# EAGLE design prototype2-only-bot-ground-plane (EAGLE 9.3.1)

## Sheet 1 of 5
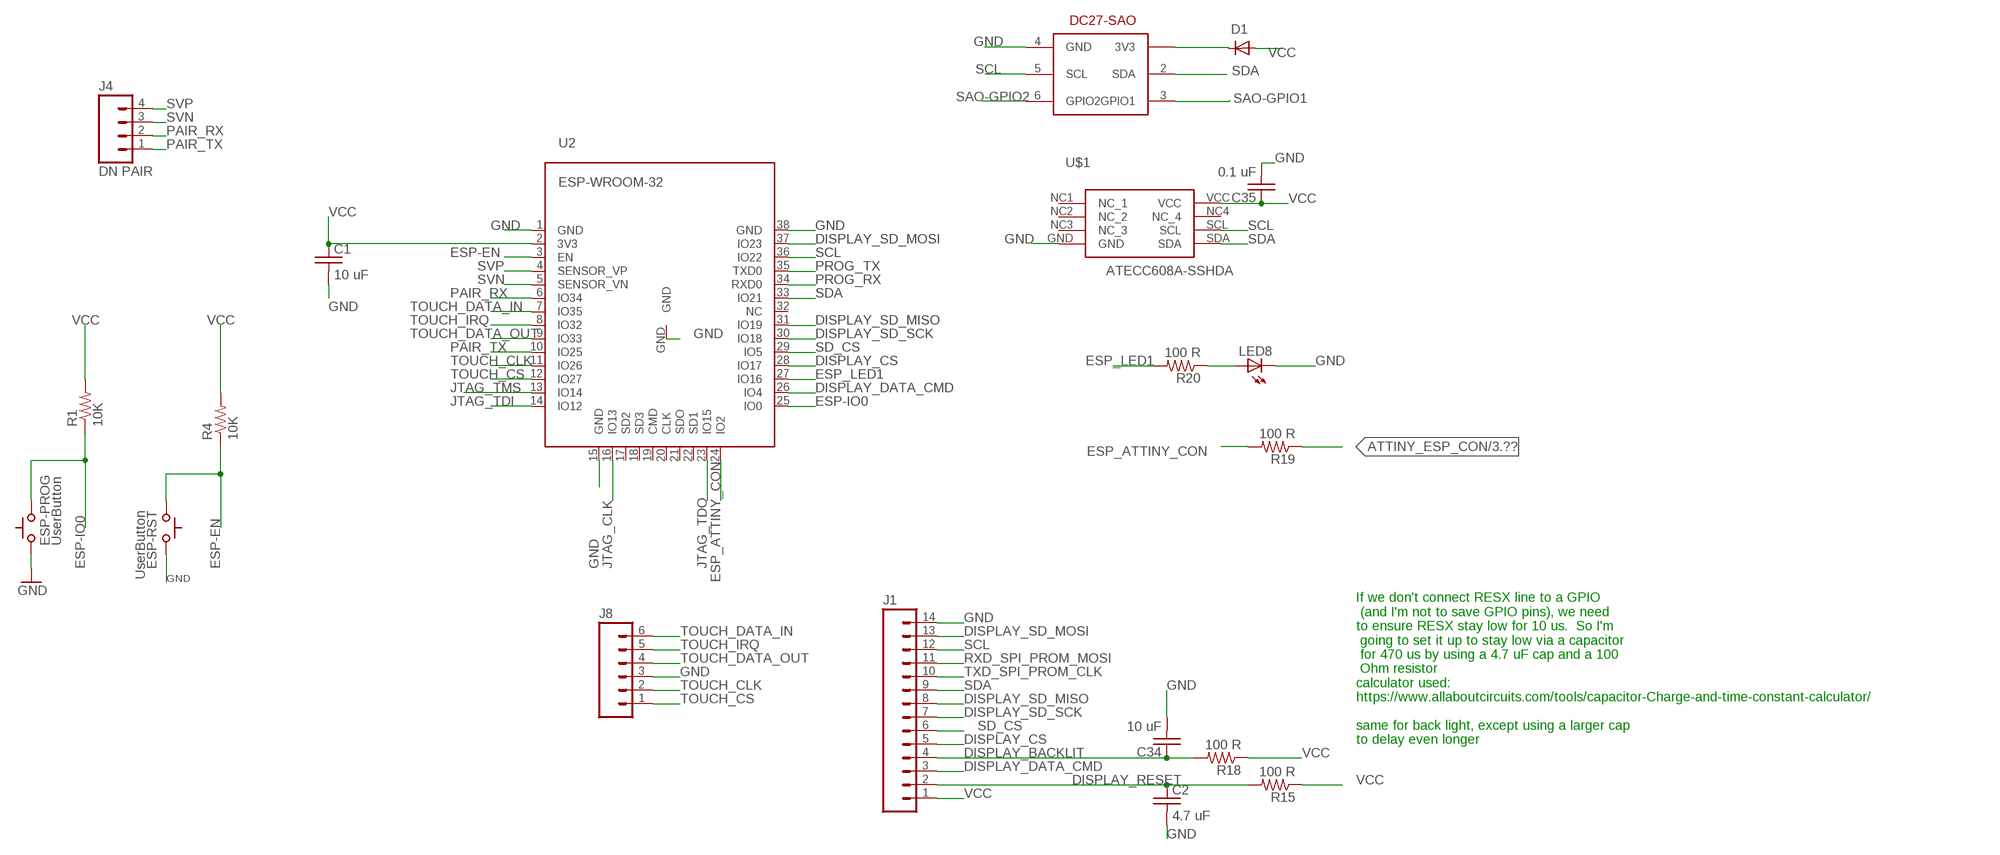
[diagram p0: schematic, sheet 1]

### Parts
C1  10 uF  C-USC0805  [C0805]
C2  4.7 uF  C-USC0805  [C0805]
C34  10 uF  C-USC0805  [C0805]
C35  0.1 uF  C-USC0805  [C0805]
D1  DIODESMA  [SMA-DIODE]
ESP-PROG  UserButton  SWITCH_TACTILETACTILE-2PIN-NARROW  [TACTILE-2PIN-NARROW]
ESP-RST  UserButton  SWITCH_TACTILETACTILE-2PIN-NARROW  [TACTILE-2PIN-NARROW]
J1  M14  [1X14]
J4  DN PAIR  M04PTH  [1X04]
J8  M06NO_SILK_YES_STOP  [1X06_NO_SILK_YES_STOP]
LED8  LED3MM  [LED3MM]
R1  10K  RESISTOR0805-RES  [0805]
R4  10K  RESISTOR0805-RES  [0805]
R15  100 R  RESISTOR0805-RES  [0805]
R18  100 R  RESISTOR0805-RES  [0805]
R19  100 R  RESISTOR0805-RES  [0805]
R20  100 R  RESISTOR0805-RES  [0805]
U2  ESP-WROOM-32  [ESP-WROOM-32]
U$1  ATECC608A-SSHDA  [8-SOIC]
U$4  DC-27-SAO  [3X2]

### Nets
ATTINY_ESP_CON: R19.1 ; also sheet 3
DISPLAY_BACKLIT: C34.1 J1.4 R18.2
DISPLAY_CS: J1.5 U2.28(IO17)
DISPLAY_DATA_CMD: J1.3 U2.26(IO4)
DISPLAY_RESET: C2.1 J1.2 R15.2
DISPLAY_SD_MISO: J1.8 U2.31(IO19)
DISPLAY_SD_MOSI: J1.13 U2.37(IO23)
DISPLAY_SD_SCK: J1.7 U2.30(IO18)
ESP-EN: ESP-RST.P$2(C) R4.1 U2.3(EN)
ESP-IO0: ESP-PROG.P$1(A) R1.1 U2.25(IO0)
ESP_ATTINY_CON: R19.2 U2.24(IO2)
ESP_LED1: R20.2 U2.27(IO16)
GND: C1.2 C2.2 C34.2 C35.2 ESP-PROG.P$2(C) ESP-RST.P$1(A) J1.14 J8.3 LED8.K(C) U2.1(GND) U2.15(GND) U2.38(GND) U2.GND U$1.GND U$4.4(GND) ; also sheet 2,3,4
JTAG_CLK: U2.16(IO13) ; also sheet 2
JTAG_TDI: U2.14(IO12) ; also sheet 2
JTAG_TDO: U2.23(IO15) ; also sheet 2
JTAG_TMS: U2.13(IO14) ; also sheet 2
N$1: D1.C U$4.1(3V3)
N$9: LED8.A R20.1
PAIR_RX: J4.2 U2.6(IO34)
PAIR_TX: J4.1 U2.10(IO25)
PROG_RX: U2.34(RXD0) ; also sheet 2
PROG_TX: U2.35(TXD0) ; also sheet 2
RXD_SPI_PROM_MOSI: J1.11 ; also sheet 2
SAO-GPIO1: U$4.3(GPIO1)
SAO-GPIO2: U$4.6(GPIO2)
SCL: J1.12 U2.36(IO22) U$1.SCL U$4.5(SCL)
SD_CS: J1.6 U2.29(IO5)
SDA: J1.9 U2.33(IO21) U$1.SDA U$4.2(SDA)
SVN: J4.3 U2.5(SENSOR_VN)
SVP: J4.4 U2.4(SENSOR_VP)
TOUCH_CLK: J8.2 U2.11(IO26)
TOUCH_CS: J8.1 U2.12(IO27)
TOUCH_DATA_IN: J8.6 U2.7(IO35)
TOUCH_DATA_OUT: J8.4 U2.9(IO33)
TOUCH_IRQ: J8.5 U2.8(IO32)
TXD_SPI_PROM_CLK: J1.10 ; also sheet 2
VCC: C1.1 C35.1 D1.A J1.1 R1.2 R4.2 R15.1 R18.1 U2.2(3V3) U$1.VCC ; also sheet 2,4
Unconnected: U2.17(SD2) U2.18(SD3) U2.19(CMD) U2.20(CLK) U2.21(SDO) U2.22(SD1) U2.32(NC) U$1.NC1(NC_1) U$1.NC2(NC_2) U$1.NC3(NC_3) U$1.NC4(NC_4)

### Notes on the sheet
- If we don't connect RESX line to a GPIO
   (and I'm not to save GPIO pins), we need 
  to ensure RESX stay low for 10 us.  So I'm
   going to set it up to stay low via a capacitor
   for 470 us by using a 4.7 uF cap and a 100
   Ohm resistor
  calculator used:
  https://www.allaboutcircuits.com/tools/capacitor-Charge-and-time-constant-calculator/
  
  same for back light, except using a larger cap 
  to delay even longer

## Sheet 2 of 5
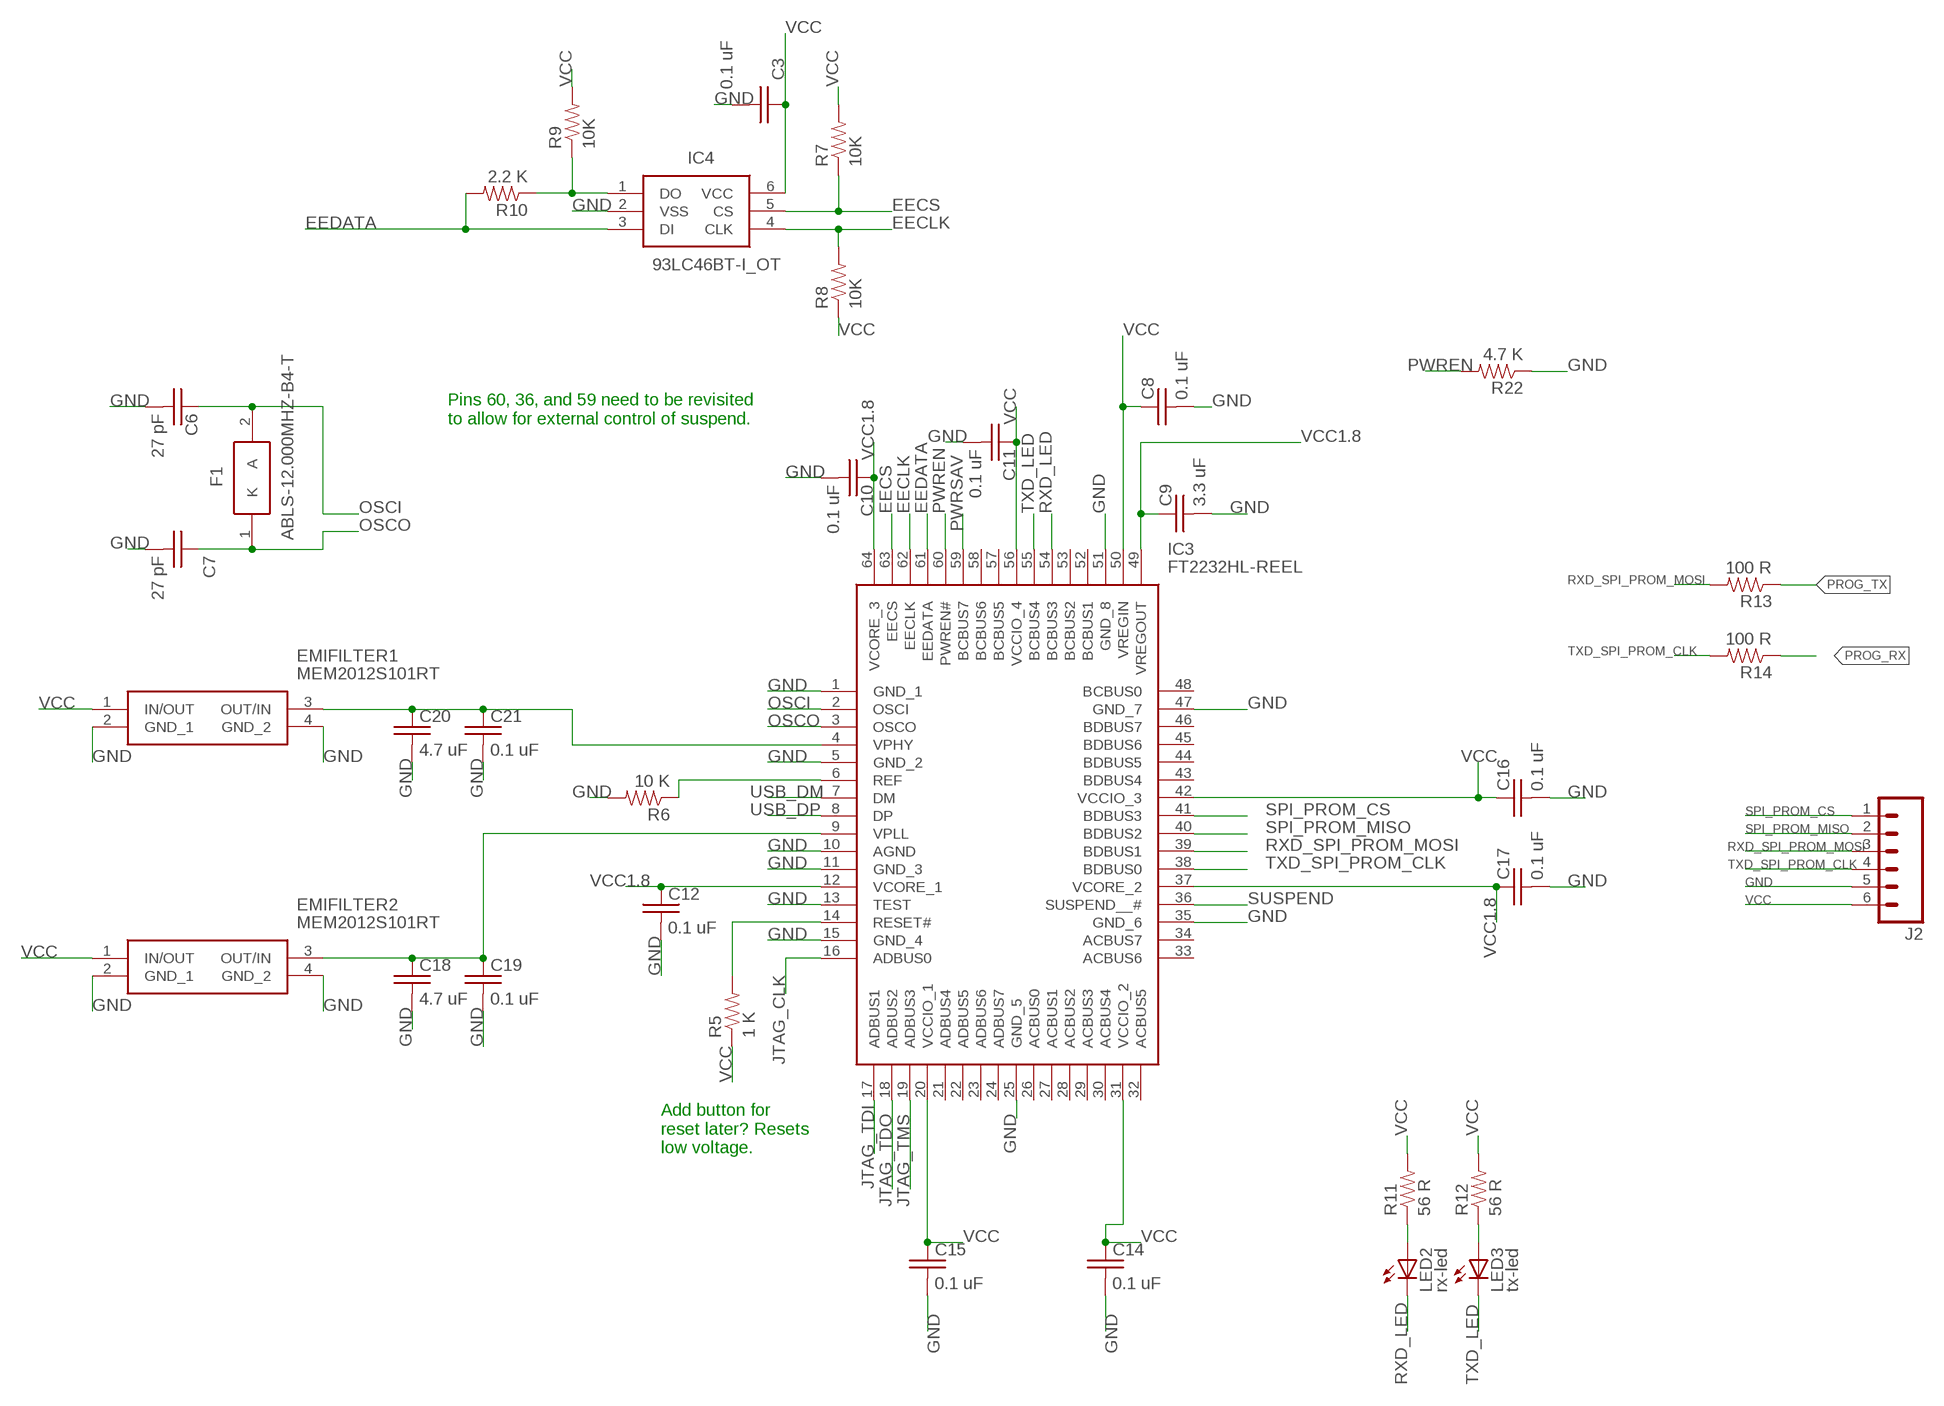
[diagram p1: schematic, sheet 2]

### Parts
C3  0.1 uF  C-USC0805  [C0805]
C6  27 pF  C-USC0805  [C0805]
C7  27 pF  C-USC0805  [C0805]
C8  0.1 uF  C-USC0805  [C0805]
C9  3.3 uF  C-USC0805  [C0805]
C10  0.1 uF  C-USC0805  [C0805]
C11  0.1 uF  C-USC0805  [C0805]
C12  0.1 uF  C-USC0805  [C0805]
C14  0.1 uF  C-USC0805  [C0805]
C15  0.1 uF  C-USC0805  [C0805]
C16  0.1 uF  C-USC0805  [C0805]
C17  0.1 uF  C-USC0805  [C0805]
C18  4.7 uF  C-USC0805  [C0805]
C19  0.1 uF  C-USC0805  [C0805]
C20  4.7 uF  C-USC0805  [C0805]
C21  0.1 uF  C-USC0805  [C0805]
EMIFILTER1  MEM2012S101RT  [MEM2012S101RT]
EMIFILTER2  MEM2012S101RT  [MEM2012S101RT]
F1  ABLS-12.000MHZ-B4-T  [HC/49US-(AT49)_1]
IC3  FT2232HL-REEL  [QFP50P1200X1200X160-64N]
IC4  93LC46BT-I_OT  [SOT95P270X145-6N]
J2  M06SILK_FEMALE_PTH  [1X06]
LED2  rx-led  LED3MM  [LED3MM]
LED3  tx-led  LED3MM  [LED3MM]
R5  1 K  RESISTOR0805-RES  [0805]
R6  10 K  RESISTOR0805-RES  [0805]
R7  10K  RESISTOR0805-RES  [0805]
R8  10K  RESISTOR0805-RES  [0805]
R9  10K  RESISTOR0805-RES  [0805]
R10  2.2 K  RESISTOR0805-RES  [0805]
R11  56 R  RESISTOR0805-RES  [0805]
R12  56 R  RESISTOR0805-RES  [0805]
R13  100 R  RESISTOR0805-RES  [0805]
R14  100 R  RESISTOR0805-RES  [0805]
R22  4.7 K  RESISTOR0805-RES  [0805]

### Nets
EECLK: IC3.62(EECLK) IC4.4(CLK) R8.2
EECS: IC3.63(EECS) IC4.5(CS) R7.1
EEDATA: IC3.61(EEDATA) IC4.3(DI) R10.2
GND: C3.2 C6.2 C7.2 C8.2 C9.2 C10.2 C11.2 C12.2 C14.2 C15.2 C16.2 C17.2 C18.2 C19.2 C20.2 C21.2 EMIFILTER1.2(GND_1) EMIFILTER1.4(GND_2) EMIFILTER2.2(GND_1) EMIFILTER2.4(GND_2) IC3.1(GND_1) IC3.5(GND_2) IC3.10(AGND) IC3.11(GND_3) IC3.13(TEST) IC3.15(GND_4) IC3.25(GND_5) IC3.35(GND_6) IC3.47(GND_7) IC3.51(GND_8) IC4.2(VSS) J2.5 R6.2 R22.1 ; also sheet 1,3,4
JTAG_CLK: IC3.16(ADBUS0) ; also sheet 1
JTAG_TDI: IC3.17(ADBUS1) ; also sheet 1
JTAG_TDO: IC3.18(ADBUS2) ; also sheet 1
JTAG_TMS: IC3.19(ADBUS3) ; also sheet 1
N$6: IC3.14(RESET#) R5.2
N$7: IC3.6(REF) R6.1
N$8: IC4.1(DO) R9.1 R10.1
N$11: LED2.A R11.1
N$13: LED3.A R12.1
N$18: C18.1 C19.1 EMIFILTER2.3(OUT/IN) IC3.9(VPLL)
N$19: C20.1 C21.1 EMIFILTER1.3(OUT/IN) IC3.4(VPHY)
OSCI: C6.1 F1.2(A) IC3.2(OSCI)
OSCO: C7.1 F1.1(K) IC3.3(OSCO)
PROG_RX: R14.1 ; also sheet 1
PROG_TX: R13.1 ; also sheet 1
PWREN: IC3.60(PWREN#) R22.2
PWRSAV: IC3.59(BCBUS7)
RXD_LED: IC3.54(BCBUS3) LED2.K(C)
RXD_SPI_PROM_MOSI: IC3.39(BDBUS1) J2.3 R13.2 ; also sheet 1
SPI_PROM_CS: IC3.41(BDBUS3) J2.1
SPI_PROM_MISO: IC3.40(BDBUS2) J2.2
SUSPEND: IC3.36(SUSPEND__#)
TXD_LED: IC3.55(BCBUS4) LED3.K(C)
TXD_SPI_PROM_CLK: IC3.38(BDBUS0) J2.4 R14.2 ; also sheet 1
USB_DM: IC3.7(DM) ; also sheet 4
USB_DP: IC3.8(DP) ; also sheet 4
VCC: C3.1 C8.1 C11.1 C14.1 C15.1 C16.1 EMIFILTER1.1(IN/OUT) EMIFILTER2.1(IN/OUT) IC3.20(VCCIO_1) IC3.31(VCCIO_2) IC3.42(VCCIO_3) IC3.50(VREGIN) IC3.56(VCCIO_4) IC4.6(VCC) J2.6 R5.1 R7.2 R8.1 R9.2 R11.2 R12.2 ; also sheet 1,4
VCC1.8: C9.1 C10.1 C12.1 C17.1 IC3.12(VCORE_1) IC3.37(VCORE_2) IC3.49(VREGOUT) IC3.64(VCORE_3)
Unconnected: IC3.21(ADBUS4) IC3.22(ADBUS5) IC3.23(ADBUS6) IC3.24(ADBUS7) IC3.26(ACBUS0) IC3.27(ACBUS1) IC3.28(ACBUS2) IC3.29(ACBUS3) IC3.30(ACBUS4) IC3.32(ACBUS5) IC3.33(ACBUS6) IC3.34(ACBUS7) IC3.43(BDBUS4) IC3.44(BDBUS5) IC3.45(BDBUS6) IC3.46(BDBUS7) IC3.48(BCBUS0) IC3.52(BCBUS1) IC3.53(BCBUS2) IC3.57(BCBUS5) IC3.58(BCBUS6)

### Notes on the sheet
- Pins 60, 36, and 59 need to be revisited 
  to allow for external control of suspend.
- Add button for 
  reset later? Resets
  low voltage.

## Sheet 3 of 5
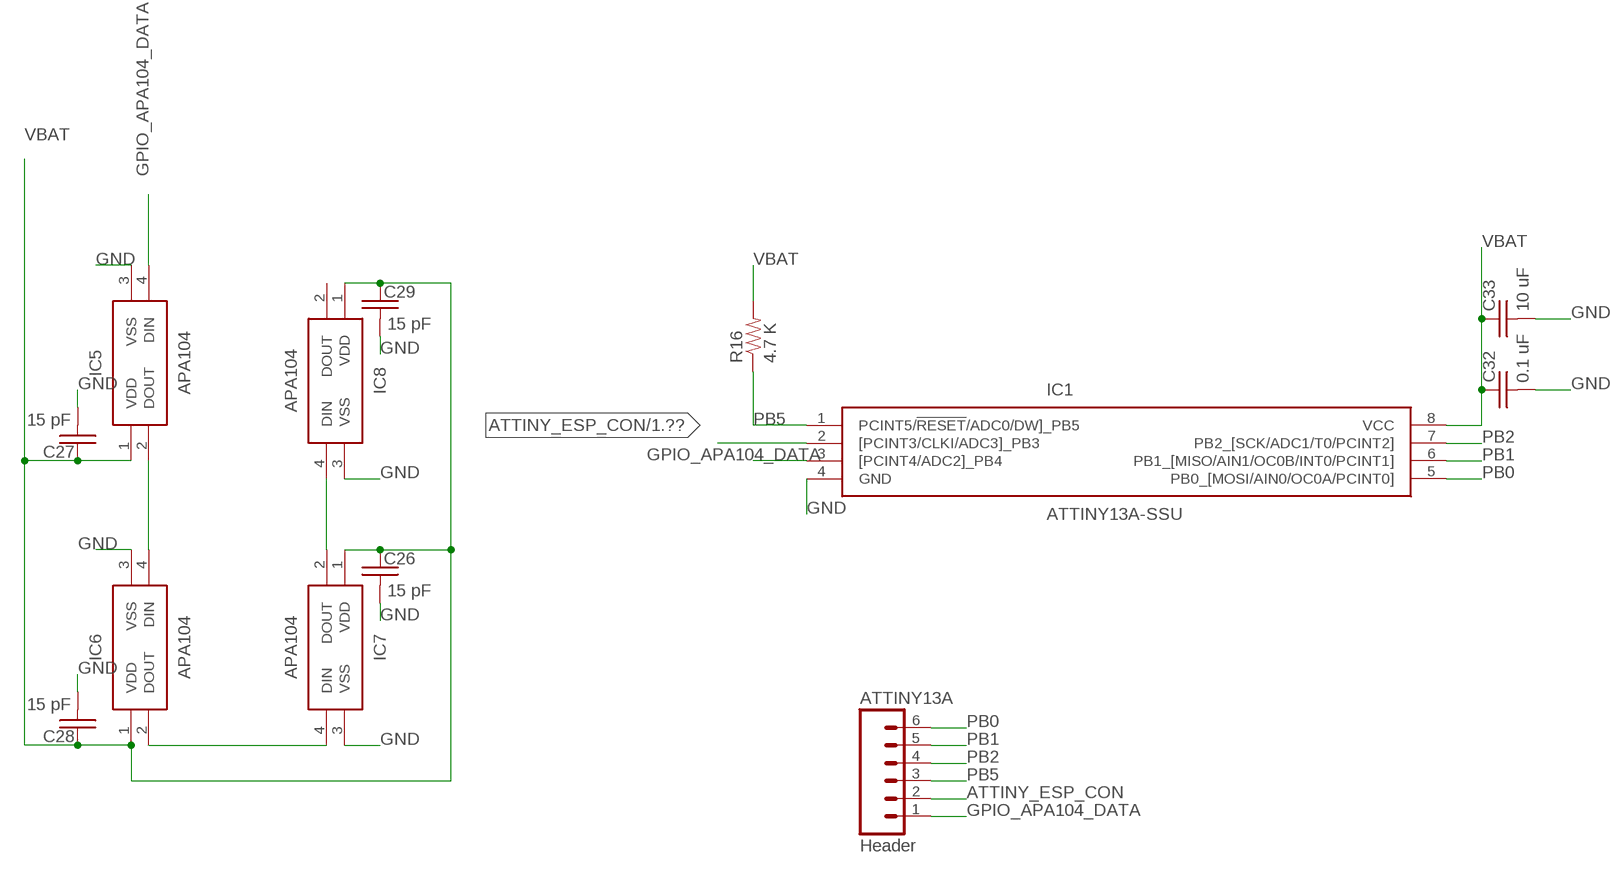
[diagram p2: schematic, sheet 3]

### Parts
ATTINY13A  Header  M06SILK_FEMALE_PTH  [1X06]
C26  15 pF  C-USC0805  [C0805]
C27  15 pF  C-USC0805  [C0805]
C28  15 pF  C-USC0805  [C0805]
C29  15 pF  C-USC0805  [C0805]
C32  0.1 uF  C-USC0805  [C0805]
C33  10 uF  C-USC0805  [C0805]
IC1  ATTINY13A-SSU  [SOIC127P600X175-8N]
IC5  APA104  [APA104]
IC6  APA104  [APA104]
IC7  APA104  [APA104]
IC8  APA104  [APA104]
R16  4.7 K  RESISTOR0805-RES  [0805]

### Nets
ATTINY_ESP_CON: ATTINY13A.2 IC1.2([PCINT3/CLKI/ADC3]_PB3) ; also sheet 1
GND: C26.2 C27.2 C28.2 C29.2 C32.2 C33.2 IC1.4(GND) IC5.3(VSS) IC6.3(VSS) IC7.3(VSS) IC8.3(VSS) ; also sheet 1,2,4
GPIO_APA104_DATA: ATTINY13A.1 IC1.3([PCINT4/ADC2]_PB4) IC5.4(DIN)
N$4: IC5.2(DOUT) IC6.4(DIN)
N$12: IC6.2(DOUT) IC7.4(DIN)
N$22: IC7.2(DOUT) IC8.4(DIN)
PB0: ATTINY13A.6 IC1.5(PB0_[MOSI/AIN0/OC0A/PCINT0])
PB1: ATTINY13A.5 IC1.6(PB1_[MISO/AIN1/OC0B/INT0/PCINT1])
PB2: ATTINY13A.4 IC1.7(PB2_[SCK/ADC1/T0/PCINT2])
PB5: ATTINY13A.3 IC1.1(PCINT5/!RESET!/ADC0/DW]_PB5) R16.1
VBAT [5v]: C26.1 C27.1 C28.1 C29.1 C32.1 C33.1 IC1.8(VCC) IC5.1(VDD) IC6.1(VDD) IC7.1(VDD) IC8.1(VDD) R16.2 ; also sheet 4
Unconnected: IC8.2(DOUT)

## Sheet 4 of 5
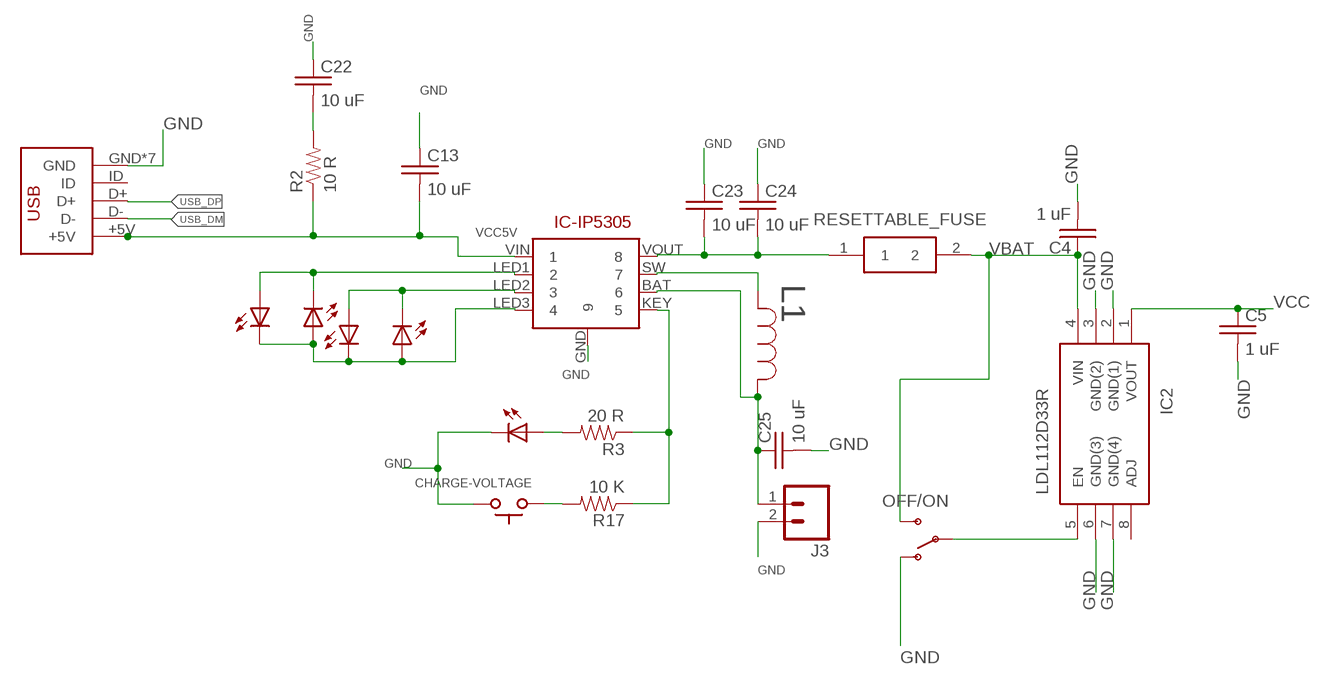
[diagram p3: schematic, sheet 4]

### Parts
C4  1 uF  C-USC0805  [C0805]
C5  1 uF  C-USC0805  [C0805]
C13  10 uF  C-USC0805  [C0805]
C22  10 uF  C-USC0805  [C0805]
C23  10 uF  C-USC0805  [C0805]
C24  10 uF  C-USC0805  [C0805]
C25  10 uF  C-USC0805  [C0805]
CHARGE-VOLTAGE  UserButton  SWITCH_TACTILETACTILE-2PIN-NARROW  [TACTILE-2PIN-NARROW]
IC2  LDL112D33R  [SOIC127P600X175-8N]
IC-IP5305  IP5305ESOP8  [SOIC127P600X165-8]
J3  M02PTH  [1X02]
L1  NRS4018T2R2MDGJ  [IND_TAIYO_NRS4018]
LED1  LED3MM  [LED3MM]
LED4  LED3MM  [LED3MM]
LED5  LED3MM  [LED3MM]
LED6  LED3MM  [LED3MM]
LED7  LED3MM  [LED3MM]
OFF/ON  SWITCH-SPSTPTH_LOCK  [SWITCH-SPDT_LOCK.007S]
R2  10 R  RESISTOR0805-RES  [0805]
R3  20 R  RESISTOR0805-RES  [0805]
R17  10 K  RESISTOR0805-RES  [0805]
RESETTABLE_FUSE  0ZCJ0050FF2G  [FUSC3216X55N]
U$2  DX4R005JJ2DX4R005JJ2  [DX4R005JJ2]

### Nets
GND: C4.2 C5.2 C13.1 C22.1 C23.1 C24.1 C25.2 CHARGE-VOLTAGE.P$1(A) IC2.2(GND(1)) IC2.3(GND(2)) IC2.6(GND(3)) IC2.7(GND(4)) IC-IP5305.GND J3.2 LED7.K(C) OFF/ON.1(O) U$2.GND U$2.P$6(GND) U$2.P$7(GND) U$2.P$8(GND) U$2.P$9(GND) U$2.P$10(GND) U$2.P$11(GND) ; also sheet 1,2,3
N$2: IC2.5(EN) OFF/ON.2(P)
N$5: IC-IP5305.LED1 LED1.A LED4.K(C)
N$10: C23.2 C24.2 IC-IP5305.VOUT RESETTABLE_FUSE.1
N$14: IC-IP5305.LED2 LED5.A LED6.K(C)
N$15: IC-IP5305.LED3 LED1.K(C) LED4.A LED5.K(C) LED6.A
N$16: C22.2 R2.2
N$17: IC-IP5305.SW L1.2
N$20: C25.1 IC-IP5305.BAT J3.1 L1.1
N$21: IC-IP5305.KEY R3.1 R17.1
N$24: LED7.A R3.2
N$25: CHARGE-VOLTAGE.P$2(C) R17.2
USB_DM: U$2.D- ; also sheet 2
USB_DP: U$2.D+ ; also sheet 2
VBAT [5v]: C4.1 IC2.4(VIN) OFF/ON.3(S) RESETTABLE_FUSE.2 ; also sheet 3
VCC: C5.1 IC2.1(VOUT) ; also sheet 1,2
VCC5V [5v]: C13.2 IC-IP5305.VIN R2.1 U$2.+5V
Unconnected: IC2.8(ADJ) U$2.ID

## Sheet 5 of 5
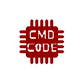
[diagram p4: schematic, sheet 5]

### Parts
U$3  CMD_C0DE_LOGOCMD_CODE_LOGO_TOP_COPPER  [CMD_C0DE_LOGO_TOP_COPPER]

## Library data of the parts
ATTINY13A J2 = connector:M06: Header 6 Standard 6-pin 0.1" header. Use with straight break away headers (SKU : PRT-00116), right angle break away headers (PRT-00553), swiss pins (PRT-00743), machine pins (PRT-00117), and female headers (PRT-00115). Molex polarized connector foot print use with SKU : PRT-08094 with associated crimp pins and housings. NOTES ON THE VARIANTS LOCK and LOCK_LONGPADS... This footprint was designed to help hold the alignment of a through-hole component (i.e. 6-pin header) while soldering it into place. You may notice that each hole has been shifted either up or down by 0.005 of an inch from it's more standard position (which is a perfectly straight line). This slight alteration caused the pins (the squares in the middle) to touch the edges of the holes. Because they are alternating, it causes a "brace" to hold the component in place. 0.005 has proven to be the perfect amount of "off-center" position when using our standard breakaway headers. Although looks a little odd when you look at the bare footprint, once you have a header in there, the alteration is very hard to notice. Also,if you push a header all the way into place, it is covered up entirely on the bottom side. This idea of altering the position of holes to aid alignment will be further integrated into the Sparkfun Library for other footprints. It can help hold any component with 3 or more connection pins.; PROD_ID: CONN-08437
C1-C29 C32-C35 = passives:C-US: CAPACITOR, American symbol
CHARGE-VOLTAGE = switches:SWITCH_TACTILE
D1 = passives:DIODE: Diode These are standard reverse protection diodes and small signal diodes. SMA package can handle up to about 1A. SOD-323 can handle about 200mA. What the SOD-323 package when ordering, there are some mfgs out there that are 5-pin packages.
EMIFILTER1 EMIFILTER2 = passives:MEM2012S101RT: EMI Filter Circuits Source: Datasheet <https://componentsearchengine.com/Datasheets/1/MEM2012S101RT.pdf>; DESCRIPTION: EMI Filter Circuits; HEIGHT: 1mm; MANUFACTURER_NAME: TDK; MANUFACTURER_PART_NUMBER: MEM2012S101RT; MOUSER_PART_NUMBER: N/A
ESP-PROG ESP-RST = dc-26:SWITCH_TACTILE
F1 = crystals-timing:ABLS-12.000MHZ-B4-T: ABRACON - ABLS-12.000MHZ-B4-T - CRYSTAL, 12MHZ, 18PF, HC-49US Source: Datasheet <https://componentsearchengine.com/Datasheets/2/ABLS-12.000MHZ-B4-T.pdf>; DESCRIPTION: ABRACON - ABLS-12.000MHZ-B4-T - CRYSTAL, 12MHZ, 18PF, HC-49US; HEIGHT: mm; MANUFACTURER_NAME: ABRACON; MANUFACTURER_PART_NUMBER: ABLS-12.000MHZ-B4-T; MOUSER_PART_NUMBER: 815-ABLS-12.0M-T; MOUSER_PRICE-STOCK: https://www.mouser.com/Search/Refine.aspx?Keyword=815-ABLS-12.0M-T; RS_PART_NUMBER: 1710207; RS_PRICE-STOCK: http://uk.rs-online.com/web/p/products/1710207
IC1 = ICs:ATTINY13A-SSU: ATTINY13A-SSU, 8 bit AVR Microcontroller 20MHz 1, 64kB, B Flash, 64B RAM, SPI 8-Pin SOIC Source: Datasheet <http://www.mouser.com/datasheet/2/268/doc8126-1315482.pdf>; DESCRIPTION: ATTINY13A-SSU, 8 bit AVR Microcontroller 20MHz 1, 64kB, B Flash, 64B RAM, SPI 8-Pin SOIC; HEIGHT: 1.75mm; MANUFACTURER_NAME: Microchip; MANUFACTURER_PART_NUMBER: ATTINY13A-SSU; MOUSER_PART_NUMBER: 556-ATTINY13A-SSU
IC2 = voltage-regulator:LDL112D33R: LDO Voltage Regulators 1.2 A low quiescent current LDO with reverse current protection Source: Datasheet <https://www.arrow.com/en/products/ldl112d33r/stmicroelectronics>; ARROW_PART_NUMBER: LDL112D33R; ARROW_PRICE/STOCK: https://www.arrow.com/en/products/ldl112d33r/stmicroelectronics; DESCRIPTION: LDO Voltage Regulators 1.2 A low quiescent current LDO with reverse current protection; HEIGHT: 1.75mm; MANUFACTURER_NAME: STMicroelectronics; MANUFACTURER_PART_NUMBER: LDL112D33R
IC3 = ICs:FT2232HL-REEL: FTDI Chip FT2232HL-REEL, USB Controller, 4-channel, 480MBps, USB 2.0, 64-Pin LQFP Source: Datasheet <https://componentsearchengine.com/Datasheets/1/FT2232HL-REEL.pdf>; DESCRIPTION: FTDI Chip FT2232HL-REEL, USB Controller, 4-channel, 480MBps, USB 2.0, 64-Pin LQFP; HEIGHT: 1.6mm; MANUFACTURER_NAME: FTDI Chip; MANUFACTURER_PART_NUMBER: FT2232HL-REEL; MOUSER_PART_NUMBER: 895-FT2232HL
IC4 = eeprom:93LC46BT-I_OT: 1K,64 X 16 Serial EE,SOT23 Source: Datasheet <https://componentsearchengine.com/Datasheets/1/93LC46BT-I_OT.pdf>; DESCRIPTION: 1K,64 X 16 Serial EE,SOT23; HEIGHT: 1.45mm; MANUFACTURER_NAME: Microchip; MANUFACTURER_PART_NUMBER: 93LC46BT-I/OT; MOUSER_PART_NUMBER: 579-93LC46BT-I/OT
IC5-IC8 = leds:APA104: APA104 LED CHIP Source: Datasheet <http://www.ledlightinghut.com/files/APA104%20Datasheet.pdf>; DESCRIPTION: APA104 LED Chip; HEIGHT: mm; MANUFACTURER_NAME: Worldsemi; MANUFACTURER_PART_NUMBER: APA104; SUPPLIER_NAME: RS
IC-IP5305 = charging-ic:IP5305: IP5305
J1 = connector:M14: Header 14 Standard 14-pin 0.1" header. Use with straight break away headers (SKU : PRT-00116), right angle break away headers (PRT-00553), swiss pins (PRT-00743), machine pins (PRT-00117), and female headers (PRT-00115).
J3 = connector:M02: Standard 2-pin 0.1" header. Use with - straight break away headers ( PRT-00116) - right angle break away headers (PRT-00553) - swiss pins (PRT-00743) - machine pins (PRT-00117) - female headers (PRT-00115) Molex polarized connector foot print use with: PRT-08233 with associated crimp pins and housings. 2.54_SCREWTERM for use with PRT-10571. 3.5mm Screw Terminal footprints for PRT-08084 5mm Screw Terminal footprints for use with PRT-08432
J4 = connector:M04: Header 4 Standard 4-pin 0.1" header. Use with straight break away headers (SKU : PRT-00116), right angle break away headers (PRT-00553), swiss pins (PRT-00743), machine pins (PRT-00117), and female headers (PRT-00115). Molex polarized connector foot print use with SKU : PRT-08231 with associated crimp pins and housings. 1MM SMD Version SKU: PRT-10208; PROD_ID: CONN-09696
J8 = connector:M06: Header 6 Standard 6-pin 0.1" header. Use with straight break away headers (SKU : PRT-00116), right angle break away headers (PRT-00553), swiss pins (PRT-00743), machine pins (PRT-00117), and female headers (PRT-00115). Molex polarized connector foot print use with SKU : PRT-08094 with associated crimp pins and housings. NOTES ON THE VARIANTS LOCK and LOCK_LONGPADS... This footprint was designed to help hold the alignment of a through-hole component (i.e. 6-pin header) while soldering it into place. You may notice that each hole has been shifted either up or down by 0.005 of an inch from it's more standard position (which is a perfectly straight line). This slight alteration caused the pins (the squares in the middle) to touch the edges of the holes. Because they are alternating, it causes a "brace" to hold the component in place. 0.005 has proven to be the perfect amount of "off-center" position when using our standard breakaway headers. Although looks a little odd when you look at the bare footprint, once you have a header in there, the alteration is very hard to notice. Also,if you push a header all the way into place, it is covered up entirely on the bottom side. This idea of altering the position of holes to aid alignment will be further integrated into the Sparkfun Library for other footprints. It can help hold any component with 3 or more connection pins.
L1 = passives:NRS4018T2R2MDGJ: Inductor: CD43; MANUFACTURER_PART_NUMBER: NRS4018T2R2MDGJ; VENDOR: TAIYO YUDEN
LED1-LED8 = leds:LED: LEDs Standard schematic elements and footprints for 5mm, 3mm, 1206, and 0603 sized LEDs. 5mm - Spark Fun Electronics SKU : COM-00529 (and others)
OFF/ON = switches:SWITCH-SPST: SPST Switch Simple slide switch.
R1 R4 R15 R18-R20 = dc-26:RESISTOR: Resistor Basic schematic elements and footprints for 0603, 1206, and PTH resistors.
R2 R3 R5-R14 R16 R17 R22 = passives:RESISTOR: Resistor Basic schematic elements and footprints for 0603, 1206, and PTH resistors.
RESETTABLE_FUSE = passives:0ZCJ0050FF2G: Resettable Fuses - PPTC <https://componentsearchengine.com/Images/9/0ZCJ0050FF2G.jpg> Source: Datasheet <https://www.belfuse.com/resources/CircuitProtection/datasheets/0ZCJ Nov2016.pdf>; DESCRIPTION: Resettable Fuses - PPTC; HEIGHT: 0.55mm; MANUFACTURER_NAME: Bel-Stewart; MANUFACTURER_PART_NUMBER: 0ZCJ0050FF2G; SUPPLIER_NAME: RS
U2 = ICs:ESP-WROOM-32
U$1 = ICs:ATECC608A-SSHDA
U$2 = connector:DX4R005JJ2
U$3 = logos:CMD_C0DE_LOGO
U$4 = defcon:DC-27-SAO: DC27SAO device

## Net classes
0 default: width 0.178 mm, drill 0.8 mm, clearance 0.178 mm
1 min: width 0.152 mm, drill 0.8 mm, clearance 0.152 mm
2 5v: width 0.254 mm, drill 0.8 mm, clearance 0.178 mm

## Board
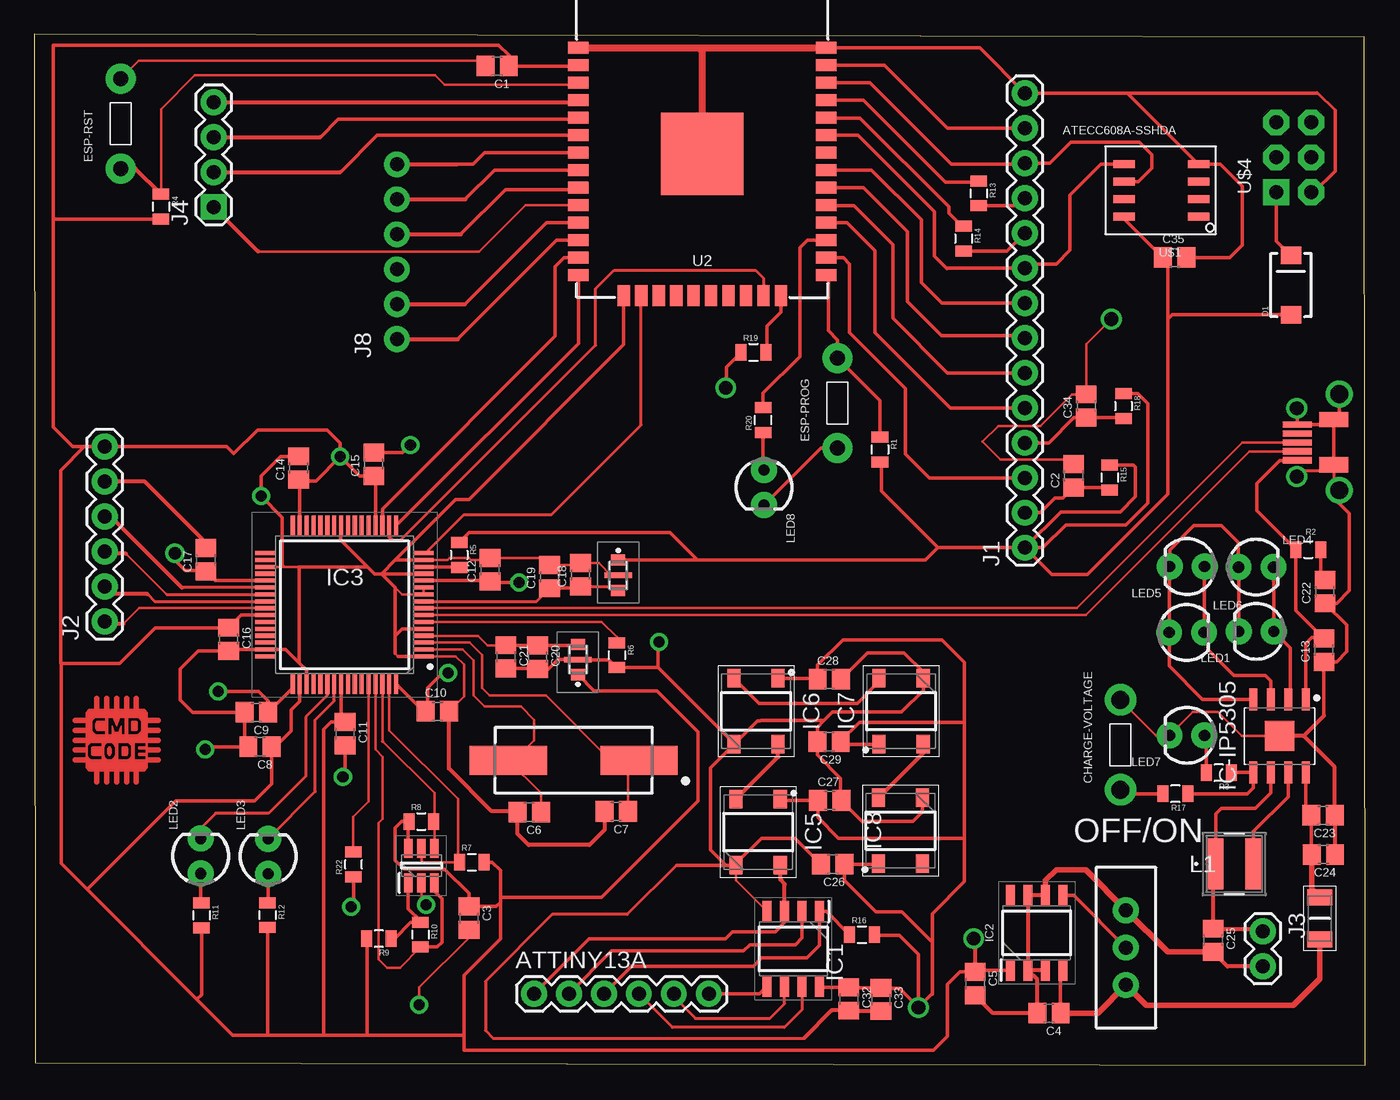
[diagram p5: board, top side]
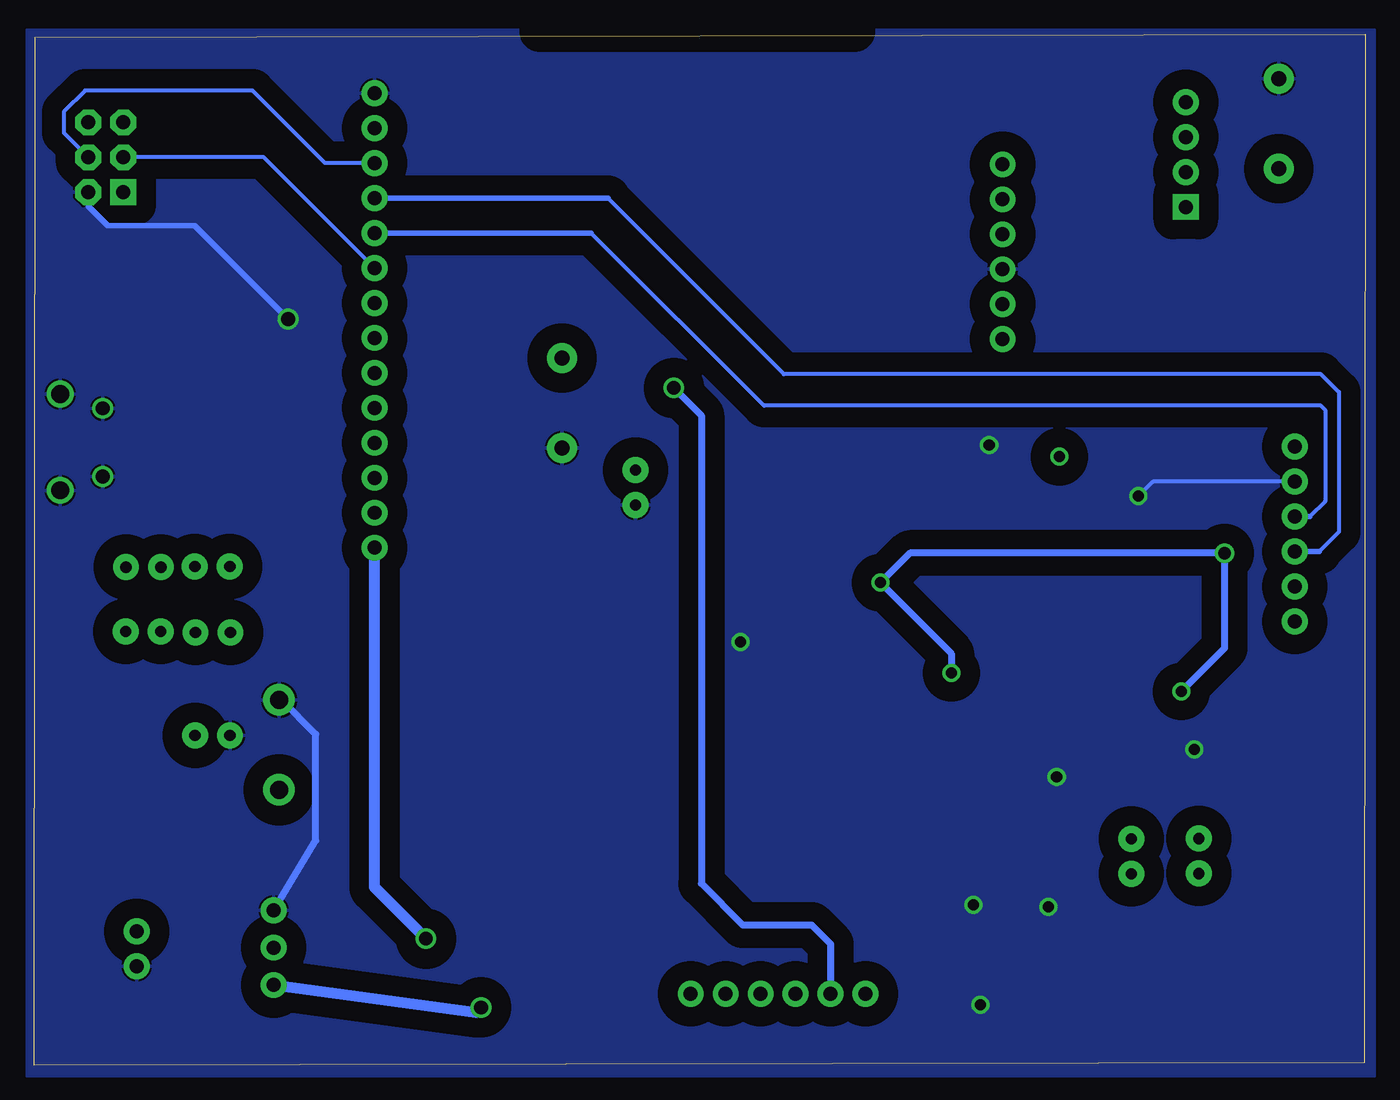
[diagram p6: board, bottom side, seen from below]

Size 96.63 x 74.87 mm. Coordinates in mm from the lower left corner, seen from the top.
Outline: 0.05,0.2 96.63,0 96.58,74.67 0,74.87 0.05,0.2
Copper layers (1*16): Top 0.035mm / dielectric 1.5mm / Bottom 0.035mm
Design rules "OthermillDRC_30_deg_v2": minimum track width 6mil, minimum drill 0.8mm, track to track 6mil, track to pad 6mil, pad to pad 6mil, via to via 6mil, smd to smd 0mil, copper to edge 0mil, drill to drill 6mil, minimum pad ring 10mil, minimum via ring 10mil, stop-mask expansion 1mil, vias tented up to drill 30mil, thermal gap 6mil

### Footprints (pad centres in the part's own frame; a part is rotated, then mirrored left to right if it is on the bottom)
1X06 = drill 1.016 pad 1.88: 1 0,0; 2 2.54,0; 3 5.08,0; 4 7.62,0; 5 10.16,0; 6 12.7,0
C0805 = smd 1.3 x 1.5: 1 -0.85,0; 2 0.85,0
TACTILE-2PIN-NARROW = drill 1.3 pad 2.3: P$1 3.264,0; P$2 -3.264,0
SMA-DIODE = smd 1.27 x 1.47: A -2.15,0; C 2.15,0
MEM2012S101RT = smd 0.8 x 1: 1 -1.1,0; 3 1.1,0 | smd 0.4 x 1: 2 0,-0.5; 4 0,0.5
TACTILE-2PIN-NARROW' = drill 1.1 pad 2.184: P$1 3.264,0; P$2 -3.264,0
HC/49US-(AT49)_1 = smd 5.6 x 2.1: 1 -4.75,0; 2 4.75,0
SOIC127P600X175-8N = smd 1.525 x 0.65: 1 -2.712,1.905; 2 -2.712,0.635; 3 -2.712,-0.635; 4 -2.712,-1.905; 5 2.712,-1.905; 6 2.712,-0.635; 7 2.712,0.635; 8 2.712,1.905
QFP50P1200X1200X160-64N = smd 1.475 x 0.3: 1 -5.738,3.75; 2 -5.738,3.25; 3 -5.738,2.75; 4 -5.738,2.25; 5 -5.738,1.75; 6 -5.738,1.25; 7 -5.738,0.75; 8 -5.738,0.25; 9 -5.738,-0.25; 10 -5.738,-0.75; 11 -5.738,-1.25; 12 -5.738,-1.75; 13 -5.738,-2.25; 14 -5.738,-2.75; 15 -5.738,-3.25; 16 -5.738,-3.75; 33 5.738,-3.75; 34 5.738,-3.25; 35 5.738,-2.75; 36 5.738,-2.25; 37 5.738,-1.75; 38 5.738,-1.25; 39 5.738,-0.75; 40 5.738,-0.25; 41 5.738,0.25; 42 5.738,0.75; 43 5.738,1.25; 44 5.738,1.75; 45 5.738,2.25; 46 5.738,2.75; 47 5.738,3.25; 48 5.738,3.75 | smd 0.3 x 1.475: 17 -3.75,-5.738; 18 -3.25,-5.738; 19 -2.75,-5.738; 20 -2.25,-5.738; 21 -1.75,-5.738; 22 -1.25,-5.738; 23 -0.75,-5.738; 24 -0.25,-5.738; 25 0.25,-5.738; 26 0.75,-5.738; 27 1.25,-5.738; 28 1.75,-5.738; 29 2.25,-5.738; 30 2.75,-5.738; 31 3.25,-5.738; 32 3.75,-5.738; 49 3.75,5.738; 50 3.25,5.738; 51 2.75,5.738; 52 2.25,5.738; 53 1.75,5.738; 54 1.25,5.738; 55 0.75,5.738; 56 0.25,5.738; 57 -0.25,5.738; 58 -0.75,5.738; 59 -1.25,5.738; 60 -1.75,5.738; 61 -2.25,5.738; 62 -2.75,5.738; 63 -3.25,5.738; 64 -3.75,5.738
SOT95P270X145-6N = smd 1.4 x 0.6: 1 -1.25,0.95; 2 -1.25,0; 3 -1.25,-0.95; 4 1.25,-0.95; 5 1.25,0; 6 1.25,0.95
APA104 = smd 1.35 x 0.95: 1 -2.4,1.6; 2 -2.4,-1.6; 3 2.4,-1.6; 4 2.4,1.6
SOIC127P600X165-8 = smd 1.609 x 0.594: BAT 2.653,-0.635; KEY 2.653,-1.905; LED1 -2.653,0.635; LED2 -2.653,-0.635; LED3 -2.653,-1.905; SW 2.653,0.635; VIN -2.653,1.905; VOUT 2.653,1.905 | smd 2.15 x 2.15: GND 0,0
1X14 = drill 1.016 pad 1.88: 1 0,0; 2 2.54,0; 3 5.08,0; 4 7.62,0; 5 10.16,0; 6 12.7,0; 7 15.24,0; 8 17.78,0; 9 20.32,0; 10 22.86,0; 11 25.4,0; 12 27.94,0; 13 30.48,0; 14 33.02,0
1X02 = drill 1.016 pad 1.88: 1 0,0; 2 2.54,0
1X04 = drill 1.016 pad 1.88 square: 1 0,0 | drill 1.016 pad 1.88: 2 2.54,0; 3 5.08,0; 4 7.62,0
1X06_NO_SILK_YES_STOP = drill 1.016 pad 1.88: 1 0,0; 2 2.54,0; 3 5.08,0; 4 7.62,0; 5 10.16,0; 6 12.7,0
IND_TAIYO_NRS4018 = smd 1.194 x 3.708: 1 -1.397,0; 2 1.397,0
LED3MM = drill 0.813 pad 1.88: A -1.27,0; K 1.27,0
SWITCH-SPDT_LOCK.007S = drill 1.016 pad 1.88: 1 0,2.718; 2 0,0; 3 0,-2.718
0805 = smd 0.8 x 1.2: 1 -0.9,0; 2 0.9,0
FUSC3216X55N = smd 1.17 x 1.82: 1 -1.52,0; 2 1.52,0
ESP-WROOM-32 = smd 0.9 x 1.5: 1 7.7,9; 2 6.43,9; 3 5.16,9; 4 3.89,9; 5 2.62,9; 6 1.35,9; 7 0.08,9; 8 -1.19,9; 9 -2.46,9; 10 -3.73,9; 11 -5,9; 12 -6.27,9; 13 -7.54,9; 14 -8.81,9; 25 -8.81,-9; 26 -7.54,-9; 27 -6.27,-9; 28 -5,-9; 29 -3.73,-9; 30 -2.46,-9; 31 -1.19,-9; 32 0.08,-9; 33 1.35,-9; 34 2.62,-9; 35 3.89,-9; 36 5.16,-9; 37 6.43,-9; 38 7.7,-9 | smd 1.5 x 0.9: 15 -10.3,5.715; 16 -10.3,4.445; 17 -10.3,3.175; 18 -10.3,1.905; 19 -10.3,0.635; 20 -10.3,-0.635; 21 -10.3,-1.905; 22 -10.3,-3.175; 23 -10.3,-4.445; 24 -10.3,-5.715 | smd 6 x 6: GND 0,0
8-SOIC = smd 0.6 x 1.55: GND 3.81,0; NC1 0,0; NC2 1.27,0; NC3 2.54,0; NC4 1.27,5.4; SCL 2.54,5.4; SDA 3.81,5.4; VCC 0,5.4
DX4R005JJ2 = smd 2.1 x 0.45: +5V 0.72,-1.32; D+ 0.72,-0.02; D- 0.72,-0.67; GND 0.72,1.28; ID 0.72,0.63 | smd 2.1 x 1.1: P$6 3.35,1.65; P$8 3.35,-1.65 | drill 1: P$7 0.675,2.45; P$9 0.675,-2.5 | drill 1.3: P$10 3.75,-3.5; P$11 3.75,3.5
3X2 = drill 1.016 pad 1.88 square: 1 -2.54,1.27 | drill 1.016 pad 1.88 octagon: 2 0,1.27; 3 2.54,1.27; 4 -2.54,-1.27; 5 0,-1.27; 6 2.54,-1.27

### Placement (x,y rotation side)
ATTINY13A  36.27,5.19 0 top
C1  33.6,72.57 180 top
C2  75.47,42.82 90 top
C3  31.56,10.69 270 top
C4  73.67,3.79 180 top
C5  68.31,5.95 270 top
C6  35.93,18.39 180 top
C7  42.26,18.44 180 top
C8  16.39,23.14 180 top
C9  16.12,25.64 180 top
C10  29.25,25.71 0 top
C11  22.56,24.08 270 top
C12  33.09,35.99 90 top
C13  93.64,30.16 90 top
C14  19.19,43.38 90 top
C15  24.64,43.65 90 top
C16  14.11,30.93 270 top
C17  12.46,36.71 90 top
C18  39.66,35.63 90 top
C19  37.41,35.5 90 top
C20  36.54,29.63 270 top
C21  34.24,29.66 270 top
C22  93.71,34.41 90 top
C23  93.57,18.16 180 top
C24  93.6,15.31 180 top
C25  85.59,9.08 270 top
C26  57.96,14.61 180 top
C27  57.76,19.24 0 top
C28  57.73,28.04 0 top
C29  57.7,23.51 180 top
C32  59.14,4.83 270 top
C33  61.47,4.79 270 top
C34  76.38,47.88 90 top
C35  82.8,58.67 0 top
CHARGE-VOLTAGE  78.87,23.28 90 top
D1  91.25,56.67 90 top
EMIFILTER1  39.47,29.47 90 top
EMIFILTER2  42.39,35.59 270 top
ESP-PROG  UserButton  [TACTILE-2PIN-NARROW']  58.32,48.1 90 top
ESP-RST  UserButton  [TACTILE-2PIN-NARROW']  6.27,68.39 90 top
F1  39.16,22.15 180 top
IC1  55.11,8.46 270 top
IC2  72.79,9.62 90 top
IC3  22.52,33.45 180 top
IC4  28.1,14.51 90 top
IC5  52.56,16.94 270 top
IC6  52.41,25.71 270 top
IC7  62.94,25.72 90 top
IC8  62.9,17.04 90 top
IC-IP5305  90.41,23.92 270 top
J1  71.94,37.59 90 top
J2  5.09,32.23 90 top
J3  89.21,9.72 270 top
J4  13.02,62.34 90 top
J8  26.32,52.73 90 top
L1  87.13,14.63 0 top
LED1  88.73,31.52 180 top
LED2  12.07,15.2 90 top
LED3  16.97,15.18 90 top
LED4  88.71,36.18 0 top
LED5  83.71,36.22 180 top
LED6  83.67,31.43 0 top
LED7  83.7,23.97 180 top
LED8  52.98,41.97 270 top
OFF/ON  79.27,8.55 0 top
R1  61.4,44.73 270 top
R2  92.51,37.45 0 top
R3  86,21.25 180 top
R4  9.2,62.36 270 top
R5  30.85,37.07 270 top
R6  42.3,29.78 270 top
R7  31.76,14.75 0 top
R8  28.1,17.7 0 top
R9  25.01,9.2 180 top
R10  28.03,9.49 270 top
R11  12.13,10.9 270 top
R12  16.93,10.91 270 top
R13  68.58,63.32 270 top
R14  67.48,60.03 270 top
R15  78.08,42.69 270 top
R16  60.1,9.48 0 top
R17  82.86,19.72 180 top
R18  79.08,47.87 270 top
R19  52.22,51.78 0 top
R20  52.92,46.86 90 top
R22  23.17,14.6 90 top
RESETTABLE_FUSE  93.34,10.67 270 top
U2  48.5,66.2 90 top
U$1  84.53,61.64 90 top
U$2  91,45.26 0 top
U$3  5.97,23.93 0 top
U$4  91.44,65.94 90 top

### Tracks (layer width: path | path; a pad name or v marks a point on that pad's centre or on a via)
ATTINY_ESP_CON  (via drill 1)
  Top 0.178: v50.2,49.2 50.25,49.25 | R19.1
  Top 0.254: ATTINY13A.2 41.92,8.3 51.5,8.3 51.95,8.75 55.25,8.75 55.75,9.24 IC1.2 | 50.25,49.25 50.25,50.7 R19.1
  Bottom 0.508: ATTINY13A.2 38.81,8.81 40.2,10.2 45.2,10.2 48.2,13.2 48.2,47.2 v50.2,49.2
DISPLAY_BACKLIT
  Top 0.254: R18.2 79.02,47.03 C34.1 75.48,47.03 73.66,45.21 J1.4
DISPLAY_CS
  Top 0.254: U2.28 59,61.2 61.05,59.15 61.05,53.2 66.5,47.75 J1.5
DISPLAY_DATA_CMD
  Top 0.254: U2.26 58.74,58.66 59.2,58.2 59.2,53.2 63.25,49.15 63.25,44.4 64.98,42.67 J1.3
DISPLAY_RESET
  Top 0.254: R15.2 77.9,41.97 C2.1 74.7,41.2 74.11,41.2 73.04,40.13 J1.2
DISPLAY_SD_MISO
  Top 0.254: U2.31 60.79,65.01 64.4,61.4 64.4,56.85 65.9,55.35 71.92,55.35 J1.8
DISPLAY_SD_MOSI
  Top 0.254: U2.37 61.72,72.63 66.3,68.05 71.92,68.05 J1.13
DISPLAY_SD_SCK
  Top 0.254: U2.30 60.21,63.74 63.4,60.55 63.4,55.45 65.85,53 71.77,53 J1.7
EECLK
  Top 0.178: IC3.62 25.27,23.54 | IC4.4 29.05,17.65 29.05,19.78 25.29,23.54
  Top 0.254: 29.05,17.65 R8.2 | 25.27,23.54 25.29,23.54
EECS
  Top 0.178: IC3.63 25.77,24.33 30.76,19.34 30.76,14.85 R7.1 28.25,14.75 28.1,14.9 IC4.5
EEDATA
  Top 0.178: IC3.61 24.77,22.93 25.3,22.4 25.3,17.9 25,17.6 25,7.7 25.6,7.1 26.54,7.1 R10.2
  Top 0.254: R10.2 29.24,8.59 29.6,8.95 29.6,12.1 29.05,12.65 IC4.3
ESP-EN
  Top 0.178: 39.34,71.2 29.8,71.2 29.1,71.9 11.65,71.9 9.2,69.45 R4.1
  Top 0.254: 39.34,71.2 U2.3
  Top 0.305: R4.1 7.33,65.13 ESP-RST.P$2
ESP-IO0
  Top 0.254: R1.1 61.4,48.28 ESP-PROG.P$1 58.32,52.68 57.65,53.35 57.65,57.24 U2.25
ESP_ATTINY_CON
  Top 0.254: U2.24 54.22,54.72 53.2,53.7 53.2,51.86 R19.2
ESP_LED1
  Top 0.254: U2.27 56.13,59.93 55.6,59.4 55.6,51.49 52.92,48.81 R20.2
GND  (via drill 0.8, 1)
  Top 0.178: IC3.1 30.6,29.7 31.19,29.11 31.19,26.8 C10.2 | IC3.15 30,36.7 30.14,36.84 31.56,36.84 31.7,36.7 32.95,36.7 C12.2 36.92,36.84 C19.2 39.53,36.35 C18.2 41,36.48 EMIFILTER2.2 EMIFILTER2.4 | 14.23,30.2 C16.2 | 26.2,29.9 26.4,29.7 | 19.75,27.73 IC3.51 | CHARGE-VOLTAGE.P$1 81.44,23.97 LED7.K 84.11,25.65 85.95,25.65 87.68,23.92 90.25,23.92 IC-IP5305.GND | 58.61,19.19 C27.2 58.55,19.3 | 64.54,28.56 IC7.3 | 52.75,25.05 52.7,25 | 50.83,23.32 IC6.3 | 50.96,14.66 IC5.3 | IC1.4 50.96,13.42 IC5.3 | 36.51,28.81 C20.2 37.33,28.78 | 39.99,29.45 EMIFILTER1.2 EMIFILTER1.4 | C3.2 31.56,9.26 27.95,5.65 v27.95,4.4 | IC4.2 28.1,12.15 28.05,12.1 28.45,11.7 v28.45,11.65 | 22.56,21.11 v22.4,20.95 | 23.17,11.67 v23,11.5 | C6.2 35.02,18.45 | 26.2,34.7 26.7,34.2 IC3.10 IC3.11 | IC3.35 18.2,36.2 | 18.2,36.2 19.2,36.2 19.22,36.18 | 15.27,23.41 C8.2 | C17.2 12.46,37.94 | C1.2 32.37,72.95 7.57,72.95 ESP-RST.P$1 | 79.2,70.61 79.37,70.61 | C2.2 75.14,44 70.14,44 68.86,45.29 69.99,46.42 73.07,46.42 75.35,48.7 76.35,48.7 C34.2 76.38,52.38 v78.2,54.2 | IC5.3 50.21,14.54 | v12.4,22.95 12.59,23.14 | 18.2,36.2 18,36.4 | v45.35,30.75 45.27,30.67
  Top 0.2: 55.89,1.98 33.3,1.98 32.75,2.53 32.75,6.1 37.6,10.95 43.05,10.95 46.64,14.54 | 93.11,70.61 93.15,70.65 94.45,69.35 | 92.9,63.4 U$4.4 | 91.72,47.67 U$2.P$7 | 93.98,46.54 U$2.P$6 94.75,47.31 | U$2.P$8 94.35,43.2 | 94.35,43.2 94.35,42.16 U$2.P$10 94.75,40.81 | U$2.P$9 92.12,43.2 94.35,43.2
  Top 0.254: 14.23,30.2 IC3.47 18.25,30.2 19.22,29.22 | IC3.5 26.7,31.7 26.2,31.2 | 26.2,31.2 26.2,29.9 | 26.4,29.7 IC3.1 | IC3.25 22.25,39.17 22.25,38.15 24.2,36.2 | 25.2,35.7 IC3.13 | 19.75,27.73 19.75,28.7 19.22,29.22 | IC8.3 64.5,18.4 63.8,17.7 60.1,17.7 58.61,19.19 | 58.55,19.3 58.55,20.85 56.85,22.55 C29.2 56.85,24.55 57.35,25.05 | C28.2 60.49,29.95 63.15,29.95 64.54,28.56 | IC7.3 64.54,27.24 62.95,25.65 57.95,25.65 57.35,25.05 | 57.35,25.05 52.75,25.05 | 52.7,25 52.5,25 50.83,23.32 45.27,28.88 | C26.2 55.22,16.5 52.8,16.5 50.96,14.66 | C21.2 36.51,28.81 | EMIFILTER1.4 38.02,29.47 37.33,28.78 | 39.99,29.45 41.73,29.45 R6.2 45.27,28.88 | C11.2 22.56,21.11 | R22.1 23.17,11.67 | IC3.15 26.2,36.7 | 26.2,36.7 25.2,35.7 | 25.2,35.7 26.2,34.7 26.2,31.2 | 24.2,36.2 19.2,36.2 | 19.22,29.22 19.22,36.18 | C16.2 11.88,30.08 10.6,28.8 10.6,26.55 11.51,25.64 C9.2 15.27,23.41 | 26.2,36.7 30.6,41.1 31.55,41.1 42.79,52.34 U2.15 | U2.38 68.65,73.9 J1.14 79.2,70.61 93.11,70.61 | 79.37,70.61 U$1.GND 86.1,65.45 87.7,63.85 87.7,59.55 86.82,58.67 C35.2 | LED8.K 57.12,44.84 ESP-PROG.P$2 | 50.21,14.54 49.1,15.65 49.1,21.6 IC6.3 | 12.59,23.14 C8.2 | C14.2 17.88,44.23 16.45,42.8 v16.45,41.35 18,39.8 18,36.4 | C15.2 26.75,44.5 v27.3,45.05 | 45.27,30.67 45.27,28.88 | 59.18,3.94 C32.2 | IC5.3 46.64,14.54 | 94.45,69.35 94.45,64.95 92.9,63.4 | 91.72,47.67 U$2.GND 93.98,46.54 | 94.75,47.31 U$2.P$11 | U$2.P$6 U$2.P$8 | 94.75,40.81 95.5,40.06 95.5,34.5 94.56,33.56 C22.1 95.3,31.97 95.3,30.05 94.56,29.31 C13.1 93.64,25.39 | 24.2,36.2 24.7,35.7 25.2,35.7
  Top 0.305: J3.2 86.64,7.18 C25.2 | IC2.6 IC2.7 IC2.2 | IC2.3 IC2.2 | IC2.2 72.82,6.24 C4.2 69.62,3.79 C5.2 | C7.2 41.41,17.11 40.3,16 35.9,16 35.08,16.82 C6.2 | C10.2 30.1,21.55 33.2,18.45 35.02,18.45 | C33.2 59.18,3.94 | C32.2 57.89,3.98 55.89,1.98 | J2.5 8.01,42.39 12.46,37.94 | 92.17,23.92 90.25,23.92 | 93.64,25.39 92.17,23.92 | 92.17,23.92 94.42,21.67 C23.1 94.42,15.34 C24.1
  Top 0.406: IC2.6 73.42,13.42 74.2,14.2 76.34,14.2 OFF/ON.1 82.31,8.23 C25.2
  Top 0.508: U2.1 48.2,73.9 | 48.2,73.9 U2.38 | U2.GND 48.5,73.6 48.2,73.9
  Bottom 0.178: 78.69,26.54 CHARGE-VOLTAGE.P$1
  Bottom 0.305: J2.5 15.41,42.39 v16.45,41.35
  Bottom 0.406: v78.2,54.2 85,61 91.3,61 92.71,62.41 U$4.4
  Bottom 0.508: OFF/ON.1 76.2,16.32 76.2,24.05 78.69,26.54
  pour Bottom (isolate 1.422): -0.7,75.2 -0.7,-0.8 97.2,-0.8 97.2,75.2
GPIO_APA104_DATA
  Top 0.254: 54.48,13.12 54.5,13.15 | ATTINY13A.1 40.28,9.2 50.2,9.2 50.7,9.7 53.8,9.7 54.48,10.38 IC1.3
  Top 0.305: IC1.3 54.48,13.12 | 54.5,13.15 54.16,13.49 IC5.4
JTAG_CLK
  Top 0.2: IC3.16 28.4,37.2 31.2,40 37.55,40 44.05,46.51 U2.16
JTAG_TDI
  Top 0.254: IC3.17 39.5,52.42 U2.14
JTAG_TDO
  Top 0.2: IC3.18 | 25.99,38.15 26.6,38.15 40.75,52.3 40.75,56.4 42.1,57.75 52.35,57.75 52.95,57.16 U2.23
  Top 0.254: 25.99,38.15 25.77,38.37 IC3.18
JTAG_TMS
  Top 0.254: IC3.19 25.27,40.42 37.8,52.95 37.8,58 38.46,58.66 U2.13
N$1
  Top 0.254: D1.C 91.2,58.82 90.17,59.85 U$4.1
N$2
  Top 0.254: OFF/ON.2 75.49,12.33 IC2.5
N$4
  Top 0.305: IC5.2 54.01,22.39 IC6.4
N$5
  Top 0.254: IC-IP5305.LED1 91.2,26.73 91.2,30.32 LED1.A 90,36.16 LED4.K
N$6
  Top 0.254: IC3.14 30.82,36.2 R5.2
N$7
  Top 0.178: IC3.6 41.2,32.2 42.3,31.1 R6.1
N$8
  Top 0.254: R9.1 26.14,9.2 27.33,10.39 R10.1 28.03,10.49 27.15,11.37 IC4.1
N$9
  Top 0.254: R20.1 52.92,43.3 LED8.A
N$10
  Top 0.254: IC-IP5305.VOUT 92.31,18.56 C23.2 92.72,15.34 C24.2
  Top 0.406: C24.2 92.75,12.78 RESETTABLE_FUSE.1
N$11
  Top 0.254: LED2.A 12.07,11.86 R11.1
N$12
  Top 0.254: IC6.2 52.62,26.3 59.75,26.3 61.34,27.89 IC7.4
N$13
  Top 0.254: LED3.A 16.97,11.85 R12.1
N$14
  Top 0.254: IC-IP5305.LED2 89.78,27.93 89.4,28.3 87.1,28.3 85.2,30.2 85.2,31.17 LED6.K 84.94,36.18 LED5.A
N$15
  Top 0.254: LED1.K 87.46,36.16 LED4.A 87.44,37.96 86.2,39.2 84.2,39.2 82.44,37.44 LED5.K 82.4,36.18 LED6.A 82.4,29 84.83,26.57 IC-IP5305.LED3
N$16
  Top 0.254: R2.2 93.41,35.56 C22.2
N$17
  Top 0.254: IC-IP5305.SW 91.05,19.5 88.53,16.98 L1.2
N$18
  Top 0.2: IC3.9 36.46,33.7 C19.1 | C18.1 42.1,34.78
  Top 0.254: C19.1 39.53,34.65 C18.1 | 42.1,34.78 EMIFILTER2.3
N$19
  Top 0.178: IC3.4 32.2,31.2 32.89,30.51 C21.1
  Top 0.254: C21.1 34.27,30.48 C20.1 39.38,30.48 EMIFILTER1.3
N$20
  Top 0.254: IC-IP5305.BAT 89.78,19.77 88.65,18.65 86.2,18.65 85.8,18.25 85.8,14.7 L1.1 85.59,14.49 | 89,9.93 J3.1
  Top 0.305: 85.59,14.49 C25.1 89,9.93
N$21
  Top 0.254: R3.1 86.92,21.27 IC-IP5305.KEY 88.51,20.15 88.07,19.72 R17.1
N$22
  Top 0.254: 64.54,22.68 IC7.2
  Top 0.305: IC8.4 64.54,22.68
N$24
  Top 0.254: R3.2 85.1,23.84 LED7.A
N$25
  Top 0.254: R17.2 79.17,19.72 CHARGE-VOLTAGE.P$2
OSCI
  Top 0.178: C6.1 36.78,19.78 F1.2 | IC3.2 31.1,30.2 31.9,29.4 31.9,26.85 32.7,26.05 35.35,26.05 36.3,25.1 36.3,23.6 34.85,22.15
  Top 0.254: 34.85,22.15 F1.2
OSCO
  Top 0.178: C7.1 43.11,21.35 | IC3.3 31.6,30.7 32.5,29.8 32.5,27.4 33.05,26.85 37.15,26.85 41.85,22.15
  Top 0.254: 43.11,21.35 F1.1 41.85,22.15
PAIR_RX
  Top 0.254: U2.6 24.9,67.55 22.23,64.88
  Top 0.305: J4.2 22.23,64.88
PAIR_TX
  Top 0.178: 16.26,59.1 32.3,59.1 35.67,62.47 U2.10
  Top 0.305: J4.1 16.26,59.1
PB0
  Top 0.254: ATTINY13A.6 52.65,5.19 IC1.5
PB1
  Top 0.2: 46.43,4.97 48,3.4 53.4,3.4 54.48,4.48 IC1.6
  Top 0.254: ATTINY13A.5 46.43,4.97
PB2
  Top 0.2: ATTINY13A.4 46.33,2.75 54.45,2.75 55.75,4.04 IC1.7
PB5
  Top 0.254: R16.1 57.51,11.17 IC1.1 57.02,8.71 56.1,7.8 52.8,7.8 52.2,7.2 43.36,7.2 ATTINY13A.3
PROG_RX
  Top 0.254: U2.34 57.52,68.8 59.95,68.8 66.4,62.35 66.4,61.9 67.37,60.93 R14.1
PROG_TX
  Top 0.254: U2.35 60.21,70.09 66.15,64.15 68.51,64.15 R13.1
PWREN
  Top 0.178: R22.2 23.15,15.52 23.15,18.05 24.27,19.17 IC3.60
RXD_LED
  Top 0.178: 12.07,17.22 LED2.K
  Top 0.2: IC3.54 21.27,26.87 19.7,25.3 19.7,21 17,18.3 13.15,18.3 12.07,17.22
RXD_SPI_PROM_MOSI
  Top 0.178: 9.6,34.2 6.64,37.16
  Top 0.2: 9.6,34.2 IC3.39
  Top 0.254: R13.2 71.37,62.42 J1.11
  Top 0.305: 6.64,37.16 5.24,37.16 J2.3
  Bottom 0.305: 54.99,62.99 42.2,50.2 3.2,50.2 1.9,48.9 1.9,38.75 3.34,37.31
  Bottom 0.406: 54.99,62.99 J1.11 | 3.34,37.31 J2.3
SCL
  Top 0.254: U2.36 60.69,71.36 66.6,65.45 71.86,65.45 J1.12 73.73,65.53 75.25,67.05 80.25,67.05 81.15,66.15 81.15,65.15 80.18,64.18 U$1.SCL
  Bottom 0.305: J1.12 75.53,65.53 80.8,70.8 92.95,70.8 94.5,69.25 94.5,67.73 U$4.5
SD_CS
  Top 0.254: U2.29 57.52,62.45 59.5,62.45 62.35,59.6 62.35,54.25 66.31,50.29 J1.6
SDA
  Top 0.254: U2.33 59.8,67.55 65.35,62 65.35,58.75 66.25,57.85 66.31,57.91 J1.9 72.23,58.2 74.2,58.2 75.2,59.2 75.2,63.2 77.45,65.45 U$1.SDA
  Bottom 0.305: J1.9 79.97,65.94 U$4.2
SPI_PROM_CS
  Top 0.178: IC3.41 7.6,33.2 6.48,32.08 | J2.1 5.24,32.08
  Top 0.305: 5.24,32.08 6.48,32.08
SPI_PROM_MISO
  Top 0.2: IC3.40 8.75,33.7 8.22,34.23
  Top 0.305: 8.22,34.23 5.63,34.23 J2.2
SVN
  Top 0.254: 20.77,67.42 22.05,68.7 39.38,68.7 U2.5
  Top 0.305: J4.3 20.77,67.42
SVP
  Top 0.254: 39.37,69.96 U2.4
  Top 0.305: J4.4 39.37,69.96
TOUCH_CLK
  Top 0.254: U2.11 37.2,61.2 31.27,55.27
  Top 0.305: J8.2 31.27,55.27
TOUCH_CS
  Top 0.254: U2.12 37.93,59.93 30.73,52.73
  Top 0.305: J8.1 30.73,52.73
TOUCH_DATA_IN
  Top 0.254: 30.68,65.43 30.7,65.45 31.85,65.45 32.68,66.28 U2.7
  Top 0.305: J8.6 30.68,65.43
TOUCH_DATA_OUT
  Top 0.254: 30.95,60.35 34.2,63.6 39.36,63.6 U2.9
  Top 0.305: J8.4 30.95,60.35
TOUCH_IRQ
  Top 0.254: U2.8 33.41,65.01 31.29,62.89
  Top 0.305: J8.5 31.29,62.89
TXD_LED
  Top 0.2: LED3.K 20.4,19.88 20.4,25.1 21.77,26.47 IC3.55
TXD_SPI_PROM_CLK
  Top 0.2: IC3.38 10.7,34.7
  Top 0.254: R14.2 70.62,59.13 J1.10
  Top 0.305: 10.7,34.7 5.55,39.85 J2.4
  Bottom 0.305: 56.2,60.45 43.65,47.9 3.2,47.9 2.9,47.6 2.9,40.95 4,39.85
  Bottom 0.406: 56.2,60.45 J1.10 | 4,39.85 J2.4
USB_DM
  Top 0.178: IC3.7 76.35,32.7 88.24,44.59 U$2.D-
USB_DP
  Top 0.178: IC3.8 75.69,33.2 87.73,45.24 U$2.D+
VBAT  (via drill 1)
  Top 0.254: C4.1 74.52,6.73 IC2.4 | R16.2 61.03,9.45 62.8,9.45 64.2,8.05 v64.2,4.2 | 65.2,8.95 63,11.15 61.1,11.15 58.81,13.44 C26.1 61.27,14.61 IC8.1 | 65.2,8.95 65.2,11 67.55,13.35 67.55,16.5 | 67.55,16.5 67.55,24.9 | 67.55,24.9 67.55,29.25 65.9,30.9 58.7,30.9 56.88,29.08 C28.1 56.81,28.11 IC6.1 | 67.55,24.9 59.9,24.9 58.55,23.55 C29.1 58.74,23.32 IC7.1 | IC5.1 54.26,19.24 C27.1 56.91,17.99 58.4,16.5 67.55,16.5 | v64.2,4.2 65.15,5.15 65.2,5.15 65.2,8.95 | IC1.8 57.08,5.68 C32.1 59.18,5.64 C33.1 61.51,5.6 62.8,5.6 v64.2,4.2
  Top 0.406: C4.1 77.23,3.79 OFF/ON.3 80.75,4.35 91.4,4.35 93.34,6.29 RESETTABLE_FUSE.2
  Bottom 0.813: OFF/ON.3 64.55,3.85 v64.2,4.2
VCC  (via drill 0.8, 1)
  Top 0.254: IC2.1 68.42,6.91 C5.1 67.2,6.8 66.3,5.9 66.3,2.1 65.3,1.1 31.2,1.1 31.2,2.2 | J1.1 74.55,40.2 78.85,40.2 79.95,41.3 79.95,43.45 79.81,43.59 R15.1 | J1.1 73.24,37.59 74.9,39.25 79.25,39.25 80.85,40.85 80.85,48.05 80.13,48.77 R18.1 | 11.8,4.8 3.83,12.77 | 3.83,12.77 1.95,14.65 1.95,29.2 | 31.2,2.2 24.15,2.2 | 24.15,2.2 21,2.2 | v68.2,9.2 68.31,9.09 | IC3.20 24.77,42.67 C15.1 23.6,42.8 v22.2,44.2 | IC3.31 19.27,42.45 | 19.27,42.45 C14.1 | IC3.42 15.03,32.7 C16.1 8.78,31.78 6.2,29.2 1.95,29.2 | IC3.50 19.27,26.42 18.65,25.8 18.65,24.3 17.49,23.14 C8.1 17.24,20.44 16,19.2 10.25,19.2 3.83,12.77 | IC3.56 22.27,25.22 C11.1 21.57,24.93 21.55,24.95 21,24.4 21,2.2 | IC4.6 27.15,17.65 R8.1 26.65,17.7 26.2,17.25 26.2,14.9 26.84,14.26 29.48,14.26 29.49,14.25 29.8,14.25 31.56,12.49 C3.1 33.54,11.54 33.85,11.85 | R9.2 24.15,9.16 24.15,2.2 | 31.2,2.2 31.2,6.55 33.85,9.2 33.85,11.85 | 33.85,11.85 33.85,12.2 | 33.85,12.2 33.85,14.15 33.25,14.75 R7.2 | 16.93,2.2 R12.2 | R11.2 12.13,5.13 11.8,4.8 | 1.95,29.2 1.9,29.2 1.9,43.2 3.63,44.93 J2.6 | v22.2,44.2 20.45,42.45 19.27,42.45 | v22.2,44.2 22.2,45.2 21.25,46.15 16.2,46.15 14.47,44.43 13.97,44.93 J2.6 | U2.2 39.44,72.57 C1.1 34.45,73.35 33.7,74.1 1.35,74.1 1.35,61.55 | 1.35,61.55 1.35,46.37 2.79,44.93 J2.6 | J1.1 65.61,37.59 65.6,37.6 | 65.6,37.6 61.5,41.7 61.5,43.73 R1.2 | J1.1 73.88,35.65 76.45,35.65 82.3,41.5 82.3,54.2 | 82.3,54.2 82.3,58.32 C35.1 79.13,61.49 U$1.VCC | 33.85,12.2 41.2,12.2 48.2,19.2 48.2,24.2 45.2,27.2 40.64,27.2 EMIFILTER1.1 | 65.6,37.6 64.69,36.69 48.15,36.69 | 48.15,36.69 EMIFILTER2.1 | R5.1 31.58,38.7 46.14,38.7 48.15,36.69
  Top 0.254: D1.A 82.62,54.52 82.3,54.2 | R4.2 1.44,61.46 1.35,61.55 | 21,2.2 16.93,2.2 | 16.93,2.2 14.4,2.2 11.8,4.8
  Top 0.305: 68.31,9.09 C5.1
  Bottom 0.813: v68.2,9.2 71.94,12.94 J1.1
VCC1.8  (via drill 0.8, 0.9)
  Top 0.254: IC3.12 33.03,35.2 C12.1 33.18,35.05 v35.2,35.05 | IC3.37 13.12,35.2 C17.1 12.37,35.95 10.95,35.95 10.2,36.7 v10.2,37.2 | IC3.64 28.27,25.71 C10.1 28.55,25.86 28.55,27.4 29.65,28.5 v30.05,28.5 | IC3.49 18.77,27.44 C9.1 16.97,26.48 16.3,27.15 v13.35,27.15
  Bottom 0.508: v13.35,27.15 10.2,30.3 v10.2,37.2 33.05,37.2 v35.2,35.05 30.05,29.9 v30.05,28.5
VCC5V
  Top 0.254: IC-IP5305.VIN 92.31,30.61 92.77,31.07 93.7,31.07 C13.2 91.61,33.04 R2.1 88.75,40.31 88.75,42.25 89.95,43.45 89.99,43.49 90.44,43.94 U$2.+5V